# EAGLE design de0_expansion (EAGLE 9.2.0)
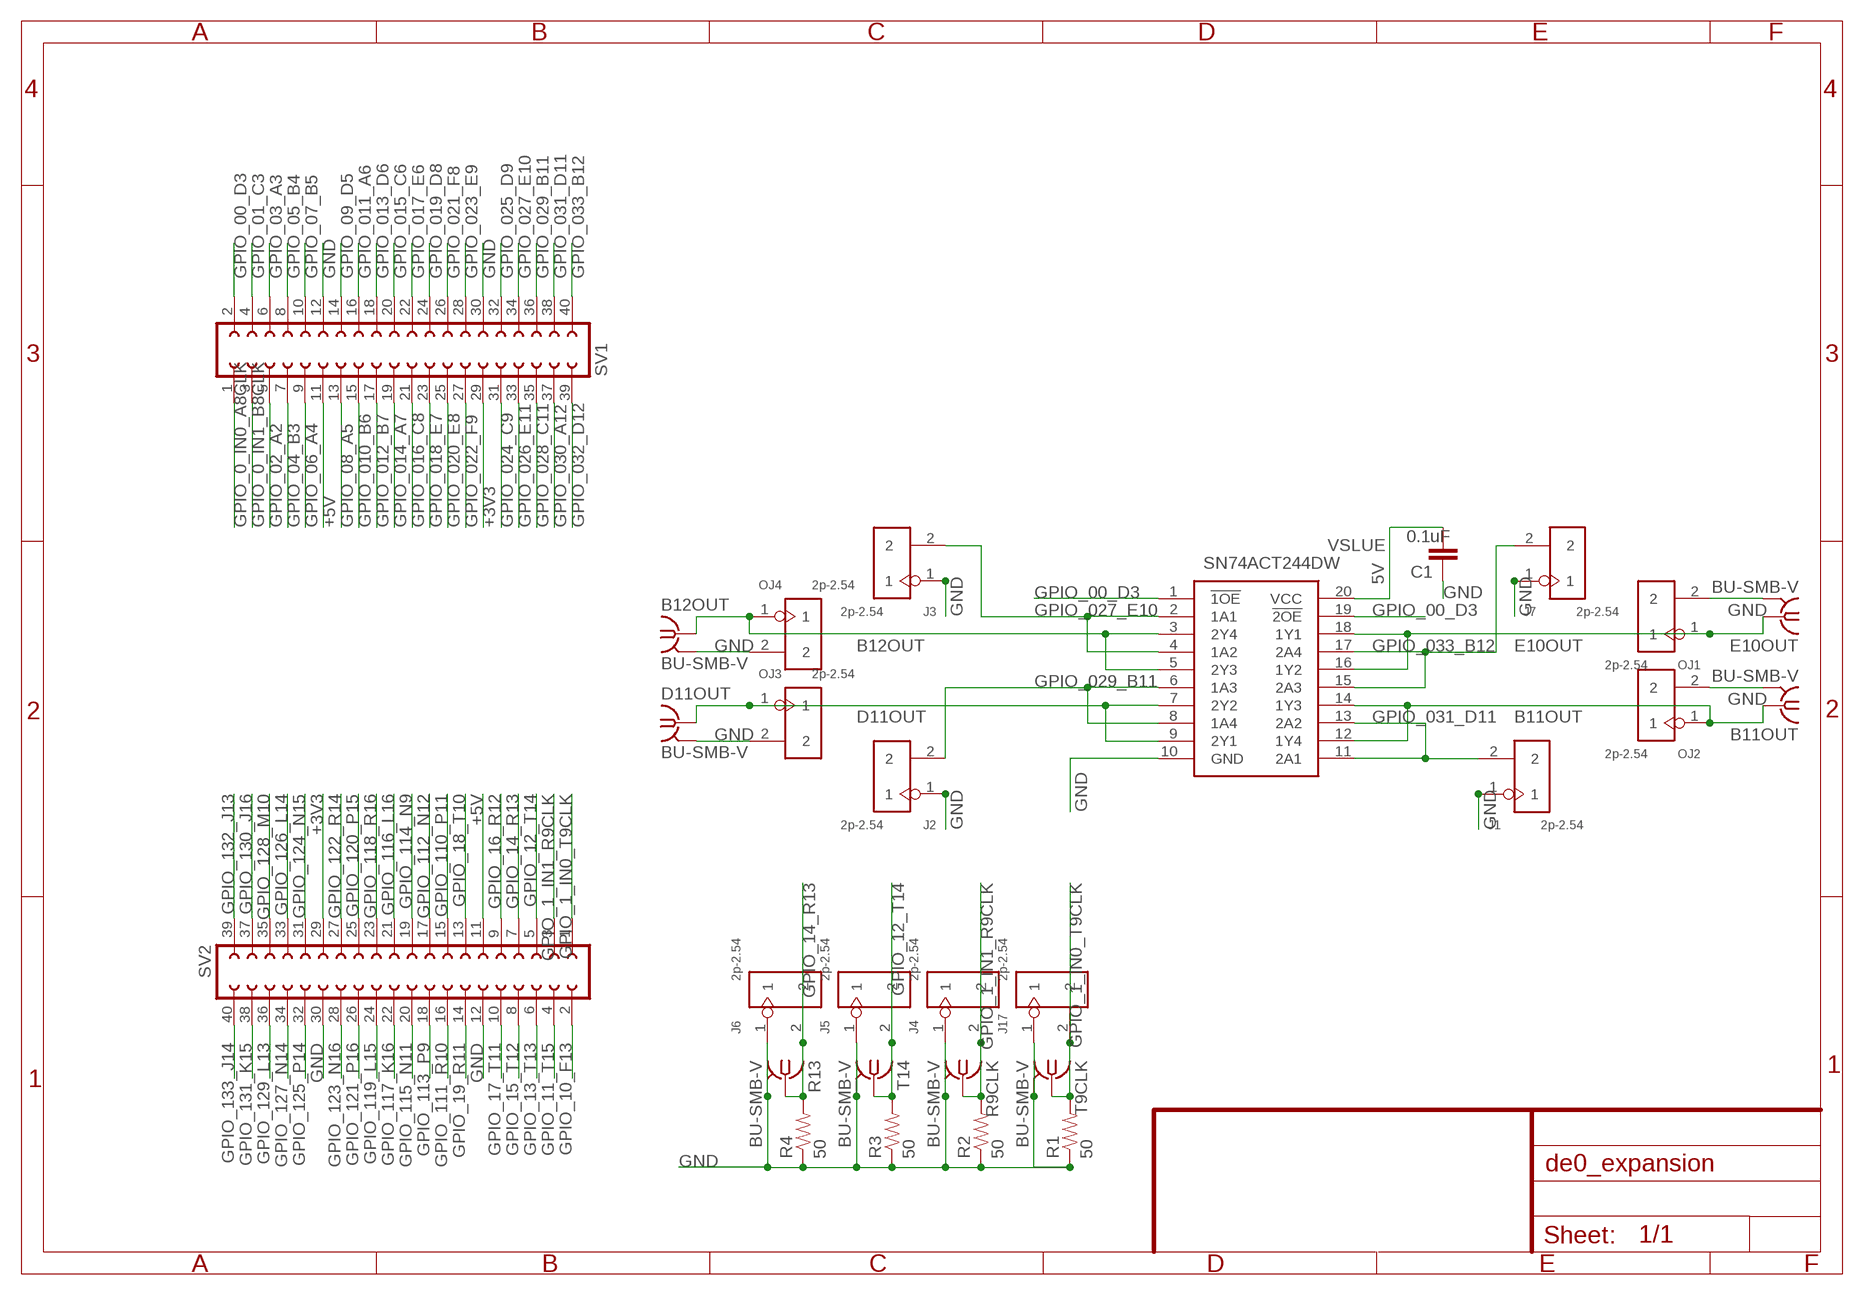
[diagram p0: schematic, sheet 1]

## Parts
B11OUT  BU-SMB-V  [BU-SMB-V]
B12OUT  BU-SMB-V  [BU-SMB-V]
C1  0.1uF  CAP0805  [0805]
D11OUT  BU-SMB-V  [BU-SMB-V]
E10OUT  BU-SMB-V  [BU-SMB-V]
J1  2p-2.54  DIP-BLACK-MALE-HEADER-VERT(2P-2.54)  [H2-2.54]
J2  2p-2.54  DIP-BLACK-MALE-HEADER-VERT(2P-2.54)  [H2-2.54]
J3  2p-2.54  DIP-BLACK-MALE-HEADER-VERT(2P-2.54)  [H2-2.54]
J4  2p-2.54  DIP-BLACK-MALE-HEADER-VERT(2P-2.54)  [H2-2.54]
J5  2p-2.54  DIP-BLACK-MALE-HEADER-VERT(2P-2.54)  [H2-2.54]
J6  2p-2.54  DIP-BLACK-MALE-HEADER-VERT(2P-2.54)  [H2-2.54]
J7  2p-2.54  DIP-BLACK-MALE-HEADER-VERT(2P-2.54)  [H2-2.54]
J17  2p-2.54  DIP-BLACK-MALE-HEADER-VERT(2P-2.54)  [H2-2.54]
OJ1  2p-2.54  DIP-BLACK-MALE-HEADER-VERT(2P-2.54)  [H2-2.54]
OJ2  2p-2.54  DIP-BLACK-MALE-HEADER-VERT(2P-2.54)  [H2-2.54]
OJ3  2p-2.54  DIP-BLACK-MALE-HEADER-VERT(2P-2.54)  [H2-2.54]
OJ4  2p-2.54  DIP-BLACK-MALE-HEADER-VERT(2P-2.54)  [H2-2.54]
R1  50  RESISTORAXIAL-0.3  [AXIAL-0.3]
R2  50  RESISTORAXIAL-0.3  [AXIAL-0.3]
R3  50  RESISTORAXIAL-0.3  [AXIAL-0.3]
R4  50  RESISTORAXIAL-0.3  [AXIAL-0.3]
R9CLK  BU-SMB-V  [BU-SMB-V]
R13  BU-SMB-V  [BU-SMB-V]
SV1  FE20-2  [FE20-2]
SV2  FE20-2  [FE20-2]
T9CLK  BU-SMB-V  [BU-SMB-V]
T14  BU-SMB-V  [BU-SMB-V]
VSLUE  SN74ACT244DW  [SOIC127P1030X265-20N]

## Nets
5V [power]: C1.2 VSLUE.20(VCC)
+3V3 [power]: SV1.29 SV2.29
+5V [power]: SV1.11 SV2.11
B11OUT: B11OUT.1 OJ2.1 VSLUE.12(1Y4) VSLUE.14(1Y3)
B12OUT: B12OUT.1 OJ4.1 VSLUE.3(2Y4) VSLUE.5(2Y3)
D11OUT: D11OUT.1 OJ3.1 VSLUE.7(2Y2) VSLUE.9(2Y1)
E10OUT: E10OUT.1 OJ1.1 VSLUE.16(1Y2) VSLUE.18(1Y1)
GND: B11OUT.2 B11OUT.3 B11OUT.4 B11OUT.5 B12OUT.2 B12OUT.3 B12OUT.4 B12OUT.5 C1.1 D11OUT.2 D11OUT.3 D11OUT.4 D11OUT.5 E10OUT.2 E10OUT.3 E10OUT.4 E10OUT.5 J1.1 J2.1 J3.1 J4.1 J5.1 J6.1 J7.1 J17.1 OJ1.2 OJ2.2 OJ3.2 OJ4.2 R1.P$1 R2.P$1 R3.P$1 R4.P$1 R9CLK.2 R9CLK.3 R9CLK.4 R9CLK.5 R13.2 R13.3 R13.4 R13.5 SV1.12 SV1.30 SV2.12 SV2.30 T9CLK.2 T9CLK.3 T9CLK.4 T9CLK.5 T14.2 T14.3 T14.4 T14.5 VSLUE.10(GND)
GPIO_00_D3: SV1.2 VSLUE.1(!1OE) VSLUE.19(!2OE)
GPIO_0_IN0_A8CLK: SV1.1
GPIO_0_IN1_B8CLK: SV1.3
GPIO_01_C3: SV1.4
GPIO_1_IN0_T9CLK: J17.2 R1.P$2 SV2.1 T9CLK.1
GPIO_1_IN1_R9CLK: J4.2 R2.P$2 R9CLK.1 SV2.3
GPIO_02_A2: SV1.5
GPIO_03_A3: SV1.6
GPIO_04_B3: SV1.7
GPIO_05_B4: SV1.8
GPIO_06_A4: SV1.9
GPIO_07_B5: SV1.10
GPIO_08_A5: SV1.13
GPIO_09_D5: SV1.14
GPIO_010_B6: SV1.15
GPIO_10_F13: SV2.2
GPIO_011_A6: SV1.16
GPIO_11_T15: SV2.4
GPIO_012_B7: SV1.17
GPIO_12_T14: J5.2 R3.P$2 SV2.5 T14.1
GPIO_013_D6: SV1.18
GPIO_13_T13: SV2.6
GPIO_014_A7: SV1.19
GPIO_14_R13: J6.2 R4.P$2 R13.1 SV2.7
GPIO_015_C6: SV1.20
GPIO_15_T12: SV2.8
GPIO_016_C8: SV1.21
GPIO_16_R12: SV2.9
GPIO_017_E6: SV1.22
GPIO_17_T11: SV2.10
GPIO_018_E7: SV1.23
GPIO_18_T10: SV2.13
GPIO_019_D8: SV1.24
GPIO_19_R11: SV2.14
GPIO_020_E8: SV1.25
GPIO_021_F8: SV1.26
GPIO_022_F9: SV1.27
GPIO_023_E9: SV1.28
GPIO_024_C9: SV1.31
GPIO_025_D9: SV1.32
GPIO_026_E11: SV1.33
GPIO_027_E10: J3.2 SV1.34 VSLUE.2(1A1) VSLUE.4(1A2)
GPIO_028_C11: SV1.35
GPIO_029_B11: J2.2 SV1.36 VSLUE.6(1A3) VSLUE.8(1A4)
GPIO_030_A12: SV1.37
GPIO_031_D11: J1.2 SV1.38 VSLUE.11(2A1) VSLUE.13(2A2)
GPIO_032_D12: SV1.39
GPIO_033_B12: J7.2 SV1.40 VSLUE.15(2A3) VSLUE.17(2A4)
GPIO_110_P11: SV2.15
GPIO_111_R10: SV2.16
GPIO_112_N12: SV2.17
GPIO_113_P9: SV2.18
GPIO_114_N9: SV2.19
GPIO_115_N11: SV2.20
GPIO_116_L16: SV2.21
GPIO_117_K16: SV2.22
GPIO_118_R16: SV2.23
GPIO_119_L15: SV2.24
GPIO_120_P15: SV2.25
GPIO_121_P16: SV2.26
GPIO_122_R14: SV2.27
GPIO_123_N16: SV2.28
GPIO_124_N15: SV2.31
GPIO_125_P14: SV2.32
GPIO_126_L14: SV2.33
GPIO_127_N14: SV2.34
GPIO_128_M10: SV2.35
GPIO_129_L13: SV2.36
GPIO_130_J16: SV2.37
GPIO_131_K15: SV2.38
GPIO_132_J13: SV2.39
GPIO_133_J14: SV2.40

## Library data of the parts
B11OUT B12OUT D11OUT E10OUT R9CLK R13 T9CLK T14 = con-coax:BU-SMB-V: FEMALE SMB CONNECTOR Radiall distributor RS 112-2993; OC_FARNELL: unknown; OC_NEWARK: unknown
C1 = SparkFun-Capacitors:CAP: Capacitor Standard 0603 ceramic capacitor, and 0.1" leaded capacitor.
J1-J7 J17 OJ1-OJ4 = Seeed-Connector:DIP-BLACK-MALE-HEADER-VERT(2P-2.54): 320020016; MPN: P125-1102A0BS116A1
R1-R4 = SparkFun-Passives:RESISTOR: Resistor Basic schematic elements and footprints for 0603, 1206, and PTH resistors.
SV1 SV2 = con-lsta:FE20-2: FEMALE HEADER; OC_FARNELL: unknown; OC_NEWARK: unknown
VSLUE = SN74ACT244DW:SN74ACT244DW: SN74ACT244DW, 8-Bit Buffer, Line Driver, ACT, 3-State Non-Inverting 4.5 5.5 V 20-Pin SOIC Source: Datasheet <http://www.ti.com/lit/ds/symlink/sn74act244.pdf>; ARROW_PART_NUMBER: SN74ACT244DW; ARROW_PRICE-STOCK: https://www.arrow.com/en/products/sn74act244dw/texas-instruments; DESCRIPTION: SN74ACT244DW, 8-Bit Buffer, Line Driver, ACT, 3-State Non-Inverting 4.5 5.5 V 20-Pin SOIC; HEIGHT: 2.65mm; MANUFACTURER_NAME: Texas Instruments; MANUFACTURER_PART_NUMBER: SN74ACT244DW; RS_PART_NUMBER: 4363169; RS_PRICE-STOCK: http://uk.rs-online.com/web/p/products/4363169

## Net classes
0 default: width 0.254 mm
1 power: width 0.762 mm

## Board
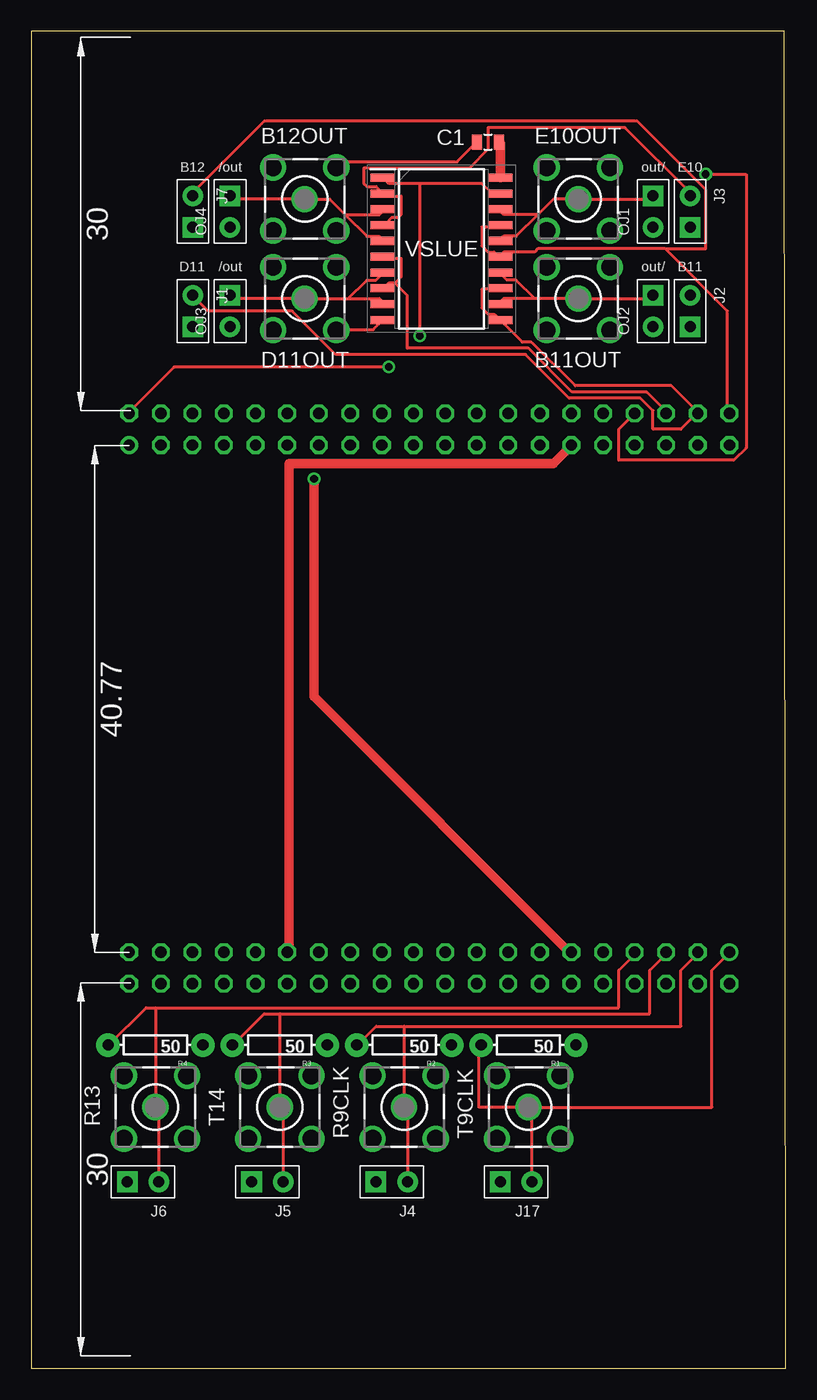
[diagram p1: board, top side]
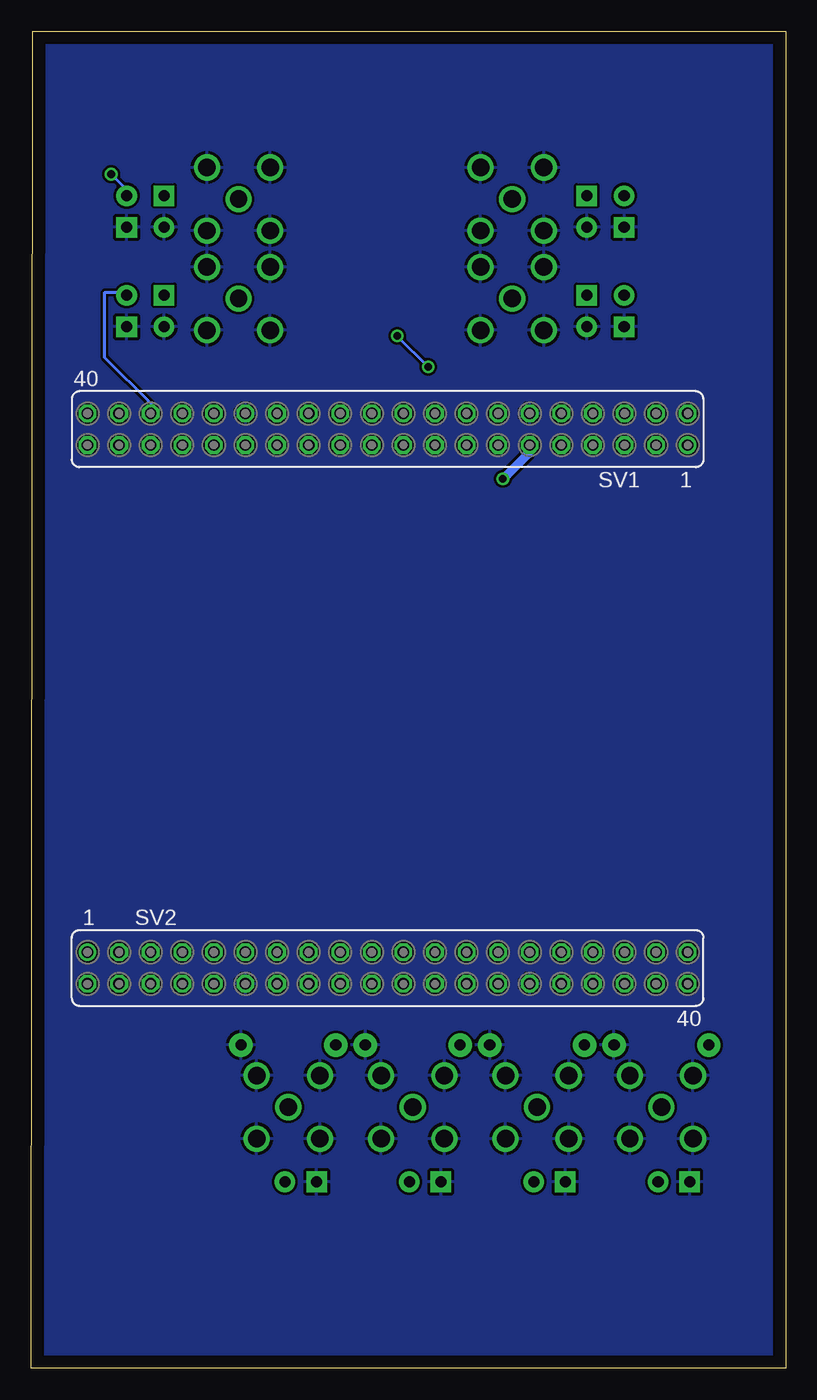
[diagram p2: board, bottom side, seen from below]

Size 60.69 x 107.5 mm. Coordinates in mm from the lower left corner, seen from the top.
Outline: 0,0 60.69,0 60.56,107.5 0,107.5 0,0
Copper layers (1*16): Top 0.035mm / dielectric 1.5mm / Bottom 0.035mm
Design rules "default": minimum track width 10mil, minimum drill 24mil, track to track 8mil, track to pad 8mil, pad to pad 8mil, via to via 8mil, smd to smd 8mil, copper to edge 40mil, drill to drill 8mil, minimum pad ring 10mil, minimum via ring 8mil, stop-mask expansion 4mil, vias tented up to drill 0mil, thermal gap 10mil

### Footprints (pad centres in the part's own frame; a part is rotated, then mirrored left to right if it is on the bottom)
BU-SMB-V = drill 1.4: 1 0,0; 2 -2.54,2.54; 3 2.54,2.54; 4 2.54,-2.54; 5 -2.54,-2.54
0805 = smd 0.8 x 1.2: 1 -0.9,0; 2 0.9,0
H2-2.54 = drill 0.889 pad 1.651 square: 1 0,1.27 | drill 0.889 pad 1.651: 2 0,-1.27
AXIAL-0.3 = drill 0.9 pad 1.88: P$1 -3.81,0; P$2 3.81,0
FE20-2 = drill 0.914: 1 -24.13,1.27 | drill 0.914 octagon: 2 -24.13,-1.27; 3 -21.59,1.27; 4 -21.59,-1.27; 5 -19.05,1.27; 6 -19.05,-1.27; 7 -16.51,1.27; 8 -16.51,-1.27; 9 -13.97,1.27; 10 -13.97,-1.27; 11 -11.43,1.27; 12 -11.43,-1.27; 13 -8.89,1.27; 14 -8.89,-1.27; 15 -6.35,1.27; 16 -6.35,-1.27; 17 -3.81,1.27; 18 -3.81,-1.27; 19 -1.27,1.27; 20 -1.27,-1.27; 21 1.27,1.27; 22 1.27,-1.27; 23 3.81,1.27; 24 3.81,-1.27; 25 6.35,1.27; 26 6.35,-1.27; 27 8.89,1.27; 28 8.89,-1.27; 29 11.43,1.27; 30 11.43,-1.27; 31 13.97,1.27; 32 13.97,-1.27; 33 16.51,1.27; 34 16.51,-1.27; 35 19.05,1.27; 36 19.05,-1.27; 37 21.59,1.27; 38 21.59,-1.27; 39 24.13,1.27; 40 24.13,-1.27
SOIC127P1030X265-20N = smd 1.95 x 0.65: 1 -4.725,5.715; 2 -4.725,4.445; 3 -4.725,3.175; 4 -4.725,1.905; 5 -4.725,0.635; 6 -4.725,-0.635; 7 -4.725,-1.905; 8 -4.725,-3.175; 9 -4.725,-4.445; 10 -4.725,-5.715; 11 4.725,-5.715; 12 4.725,-4.445; 13 4.725,-3.175; 14 4.725,-1.905; 15 4.725,-0.635; 16 4.725,0.635; 17 4.725,1.905; 18 4.725,3.175; 19 4.725,4.445; 20 4.725,5.715

### Placement (x,y rotation side)
B11OUT  44,86 270 top
B12OUT  22,94 270 top
C1  36.74,98.58 0 top
D11OUT  22,86 270 top
E10OUT  44,94 270 top
J1  13,85 180 top
J2  53,85 180 top
J3  53,93 180 top
J4  29,15 90 top
J5  19,15 90 top
J6  9,15 90 top
J7  13,93 180 top
J17  39,15 90 top
OJ1  50,93 0 top
OJ2  50,85 0 top
OJ3  16,85 0 top
OJ4  16,93 0 top
R1  40,26 180 top
R2  30,26 180 top
R3  20,26 180 top
R4  10,26 180 top
R9CLK  30,21 0 top
R13  10,21 0 top
SV1  32.02,75.5 180 bottom
SV2  32.02,32.19 0 bottom
T9CLK  40,21 0 top
T14  20,21 0 top
VSLUE  33,90 0 top

### Tracks (layer width: path | path; a pad name or v marks a point on that pad's centre or on a via)
5V
  Top 0.762: C1.2 37.75,98.5 37.75,95.75 VSLUE.20
+3V3
  Top 0.762: SV2.29 20.75,33.5 20.75,72.75 42,72.75 43.25,74 SV1.29
+5V  (via drill 0.61)
  Top 0.762: v22.75,71.5 22.75,54 43.25,33.5 SV2.11
  Bottom 0.762: v22.75,71.5 20.75,73.5 20.75,74 SV1.11
B11OUT
  Top 0.254: 40.5,86 B11OUT.1 49.75,86 50,86.25 OJ2.1 | 40.5,86 38,86 37.75,85.75 VSLUE.12 | 40.5,86 39,87.5 38.25,87.5 37.75,88 VSLUE.14
B12OUT
  Top 0.254: 25.25,92.75 24,94 B12OUT.1 16.25,94 16,94.25 OJ4.1 | 25.25,92.75 27,91 28,91 28.25,90.75 VSLUE.5 | 25.25,92.75 28,92.75 28.25,93 VSLUE.3
D11OUT
  Top 0.254: 25.5,86 D11OUT.1 16.25,86 16,86.25 OJ3.1 | 25.5,86 28,86 28.25,85.75 VSLUE.9 | 25.5,86 27,87.5 27.75,87.5 28.25,88 VSLUE.7
E10OUT
  Top 0.254: 40.75,92.75 42,94 E10OUT.1 49.75,94 50,94.25 OJ1.1 | 40.75,92.75 39,91 38,91 37.75,90.75 VSLUE.16 | 40.75,92.75 38,92.75 37.75,93 VSLUE.18
GND
  Top 0.254: B12OUT.2 25,97 34.25,97 35.75,98.5 C1.1 | VSLUE.10 28.25,84.25 27.5,83.5 24.75,83.5 D11OUT.3
  pour Bottom: -1,108.45 62.58,108.57 62.58,-1 -1,-1
GPIO_00_D3  (via drill 0.61)
  Top 0.254: 31.25,95.25 36.25,95.25 37,94.5 37.5,94.5 VSLUE.19 | 31.25,95.25 28.75,95.25 28.5,95.5 VSLUE.1 | v28.75,80.5 11.5,80.5 8,77 SV1.2 | 31.25,95.25 v31.25,83
  Bottom 0.254: v31.25,83 v28.75,80.5
GPIO_1_IN0_T9CLK
  Top 0.254: 40.25,21 54.75,21 54.75,32 56,33.25 SV2.1 | 40.25,21 40.25,15 J17.2 | 40.25,21 T9CLK.1 36,21 36,26 R1.P$2
GPIO_1_IN1_R9CLK
  Top 0.254: J4.2 30.25,15 30.25,21 R9CLK.1 30,27.5 | 30,27.5 27.75,27.5 26.25,26 R2.P$2 | 30,27.5 52.25,27.5 52.25,32 53.5,33.25 SV2.3
GPIO_12_T14
  Top 0.254: J5.2 20.25,15 20.25,21 T14.1 20,28.5 | 20,28.5 18.75,28.5 16.25,26 R3.P$2 | 20,28.5 49.75,28.5 49.75,32 51,33.25 SV2.5
GPIO_14_R13
  Top 0.254: J6.2 10.25,15 10.25,21 R13.1 10,29 | 10,29 9.25,29 6.25,26 R4.P$2 | 10,29 47.25,29 47.25,32 48.5,33.25 SV2.7
GPIO_027_E10  (via drill 0.61)
  Top 0.254: VSLUE.4 28.5,92 29,92.5 29.5,92.5 29.75,92.75 29.75,94.25 28.5,94.25 VSLUE.2 28.25,94.5 27.75,95 27,95 26.75,95.25 26.75,96.5 35.25,96.5 36.75,98 36.75,99.75 47.75,99.75 53,94.5 J3.2 | v54.25,96 57.5,96 57.5,74 56.5,73 47.25,73 47.25,75.5 48.5,76.75 SV1.34
  Bottom 0.254: v54.25,96 53,94.75 J3.2
GPIO_029_B11
  Top 0.254: 29.25,87.25 28.75,87.25 28.5,87 VSLUE.8 | 29.25,87.25 29.75,87.75 29.75,89.25 28.5,89.25 VSLUE.6 | 29.25,87.25 30.25,86.25 30.25,82 40,82 43.5,78.5 49.5,78.5 51,77 SV1.36
  Bottom 0.254: J2.2 53,86.5 54.75,86.5 54.75,81.25 51,77.5 51,77 SV1.36
GPIO_031_D11
  Top 0.254: VSLUE.13 37.5,86.75 36.25,86.75 36.25,85.25 36.75,84.75 37.25,84.75 37.5,84.5 VSLUE.11 37.75,84.25 39.5,82.5 40.25,82.5 43.75,79 51.5,79 53.5,77 SV1.38 53.5,76.75 52.25,75.5 50,75.5 50,77 49,78 43.25,78 39.75,81.5 24.5,81.5 21,85 14.25,85 13,86.25 J1.2
GPIO_033_B12
  Top 0.254: VSLUE.17 37.5,91.75 36.25,91.75 36.25,90.25 36.75,89.75 37.25,89.75 37.5,89.5 VSLUE.15 37.75,89.5 38,89.75 40.5,89.75 40.75,90 51,90 | 51,90 56,85 56,77 SV1.40 | 51,90 54.25,90 54.25,94.75 48.75,100.25 18.75,100.25 13,94.5 J7.2

### Text on the board
tPlace: B12 | /out | out/ | E10 | D11 | /out | out/ | B11
201bmp: /home/alvieboy/zpuino32-800x600.bmp